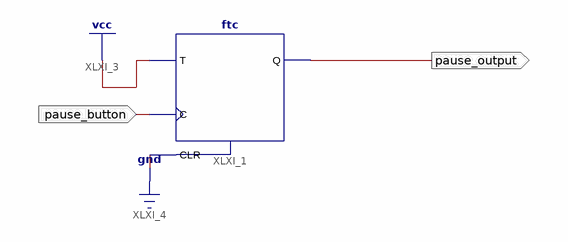
[diagram p0: schematic sheet 1]
// Xilinx ISE schematic pause_resume.sch (spartan6) as structural Verilog: 1 symbols, 2 ports
module pause_resume (
  input  pause_button,
  output pause_output
);

  ftc XLXI_1 (.C(pause_button), .CLR(1'b0), .T(1'b1), .Q(pause_output));
endmodule
